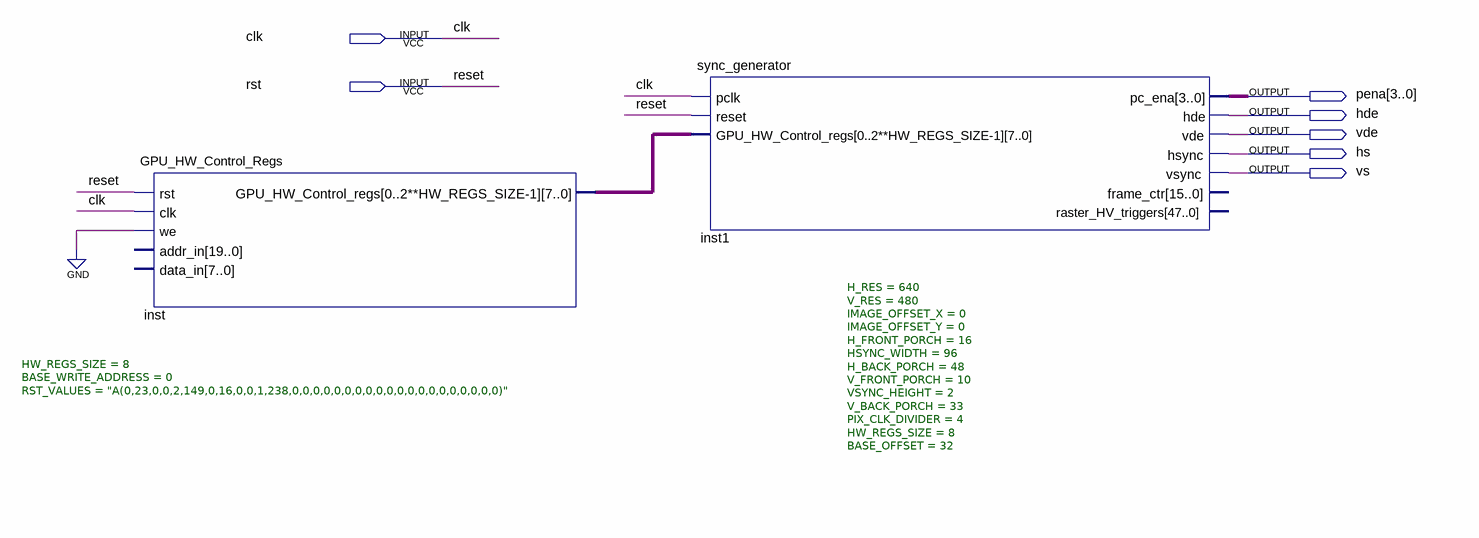
[diagram p0: schematic sheet]
// Quartus schematic sync_gen_sim.bdf as structural Verilog: 2 symbols, 7 pins
module sync_gen_sim (
  input  clk,
  input  rst,
  output [3:0] pena,
  output hde,
  output vde,
  output hs,
  output vs
);

  wire inst_gpu_hw_control_regs;

  GPU_HW_Control_Regs #(.HW_REGS_SIZE(8), .BASE_WRITE_ADDRESS(0), .RST_VALUES("A(0,23,0,0,2,149,0,16,0,0,1,238,0,0,0,0,0,0,0,0,0,0,0,0,0,0,0,0,0,0,0,0)")) inst (
    .rst(rst), .clk(clk), .we(1'b0), .GPU_HW_Control_regs(inst_gpu_hw_control_regs));  // open: addr_in, data_in
  sync_generator #(.H_RES(640), .V_RES(480), .IMAGE_OFFSET_X(0), .IMAGE_OFFSET_Y(0), .H_FRONT_PORCH(16), .HSYNC_WIDTH(96), .H_BACK_PORCH(48), .V_FRONT_PORCH(10), .VSYNC_HEIGHT(2), .V_BACK_PORCH(33), .PIX_CLK_DIVIDER(4), .HW_REGS_SIZE(8), .BASE_OFFSET(32)) inst1 (
    .pclk(clk), .reset(rst), .GPU_HW_Control_regs(inst_gpu_hw_control_regs), .pc_ena(pena), .hde(hde),
    .vde(vde), .hsync(hs), .vsync(vs));  // open: frame_ctr, raster_HV_triggers

  // Other names for the same wires on the sheet: reset = rst
endmodule
